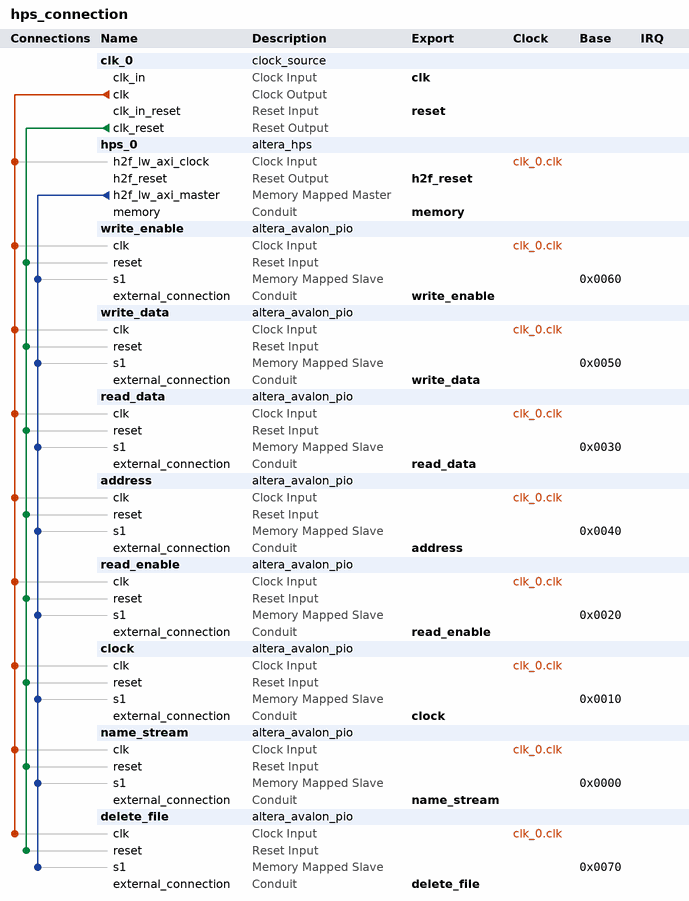
[diagram p0: system contents]
# Platform Designer (Qsys) system hps_connection, Cyclone V 5CSEMA5F31C6
# Parameters at their usual value, and those the tool derives, are not listed.
package require -exact qsys 23.1
create_system hps_connection
set_project_property DEVICE_FAMILY {Cyclone V}
set_project_property DEVICE 5CSEMA5F31C6

add_instance clk_0 clock_source 23.1
set_instance_parameter_value clk_0 clockFrequency 50000000

add_instance hps_0 altera_hps 23.1
set_instance_parameter_value hps_0 EMAC1_Mode N/A
set_instance_parameter_value hps_0 EMAC1_PinMuxing Unused
set_instance_parameter_value hps_0 F2SCLK_COLDRST_Enable false
set_instance_parameter_value hps_0 F2SCLK_DBGRST_Enable false
set_instance_parameter_value hps_0 F2SCLK_WARMRST_Enable false
set_instance_parameter_value hps_0 F2SINTERRUPT_Enable false
set_instance_parameter_value hps_0 F2S_Width 0
set_instance_parameter_value hps_0 FPGA_PERIPHERAL_OUTPUT_CLOCK_FREQ_EMAC0_GTX_CLK 125
set_instance_parameter_value hps_0 FPGA_PERIPHERAL_OUTPUT_CLOCK_FREQ_EMAC0_MD_CLK 2.5
set_instance_parameter_value hps_0 FPGA_PERIPHERAL_OUTPUT_CLOCK_FREQ_EMAC1_GTX_CLK 125
set_instance_parameter_value hps_0 FPGA_PERIPHERAL_OUTPUT_CLOCK_FREQ_EMAC1_MD_CLK 2.5
set_instance_parameter_value hps_0 HPS_PROTOCOL DDR3
set_instance_parameter_value hps_0 I2C0_Mode N/A
set_instance_parameter_value hps_0 I2C0_PinMuxing Unused
set_instance_parameter_value hps_0 I2C1_Mode N/A
set_instance_parameter_value hps_0 I2C1_PinMuxing Unused
set_instance_parameter_value hps_0 LWH2F_Enable true
set_instance_parameter_value hps_0 MEM_BANKADDR_WIDTH 3
set_instance_parameter_value hps_0 MEM_CLK_FREQ 300.0
set_instance_parameter_value hps_0 MEM_CLK_FREQ_MAX 400.0
set_instance_parameter_value hps_0 MEM_COL_ADDR_WIDTH 8
set_instance_parameter_value hps_0 MEM_DQ_WIDTH 8
set_instance_parameter_value hps_0 MEM_DRV_STR RZQ/6
set_instance_parameter_value hps_0 MEM_ROW_ADDR_WIDTH 12
set_instance_parameter_value hps_0 MEM_RTT_NOM {ODT Disabled}
set_instance_parameter_value hps_0 MEM_RTT_WR {Dynamic ODT off}
set_instance_parameter_value hps_0 MEM_TCL 7
set_instance_parameter_value hps_0 MEM_TFAW_NS 37.5
set_instance_parameter_value hps_0 MEM_TINIT_US 499
set_instance_parameter_value hps_0 MEM_TMRD_CK 3
set_instance_parameter_value hps_0 MEM_TRAS_NS 40.0
set_instance_parameter_value hps_0 MEM_TRCD_NS 15.0
set_instance_parameter_value hps_0 MEM_TREFI_US 7.0
set_instance_parameter_value hps_0 MEM_TRFC_NS 75.0
set_instance_parameter_value hps_0 MEM_TRP_NS 15.0
set_instance_parameter_value hps_0 MEM_TWTR 2
set_instance_parameter_value hps_0 MEM_VENDOR JEDEC
set_instance_parameter_value hps_0 MEM_WTCL 6
set_instance_parameter_value hps_0 MPU_EVENTS_Enable true
set_instance_parameter_value hps_0 QSPI_Mode N/A
set_instance_parameter_value hps_0 QSPI_PinMuxing Unused
set_instance_parameter_value hps_0 REF_CLK_FREQ 125.0
set_instance_parameter_value hps_0 S2FCLK_USER2CLK 5
set_instance_parameter_value hps_0 S2F_Width 0
set_instance_parameter_value hps_0 SDIO_Mode N/A
set_instance_parameter_value hps_0 SDIO_PinMuxing Unused
set_instance_parameter_value hps_0 SPIM1_Mode N/A
set_instance_parameter_value hps_0 SPIM1_PinMuxing Unused
set_instance_parameter_value hps_0 STM_Enable false
set_instance_parameter_value hps_0 TIMING_BOARD_AC_SKEW 0.02
set_instance_parameter_value hps_0 TIMING_BOARD_AC_TO_CK_SKEW 0.0
set_instance_parameter_value hps_0 TIMING_BOARD_DQ_TO_DQS_SKEW 0.0
set_instance_parameter_value hps_0 TIMING_BOARD_MAX_CK_DELAY 0.6
set_instance_parameter_value hps_0 TIMING_BOARD_MAX_DQS_DELAY 0.6
set_instance_parameter_value hps_0 TIMING_BOARD_SKEW_BETWEEN_DQS 0.02
set_instance_parameter_value hps_0 TIMING_BOARD_SKEW_CKDQS_DIMM_MAX 0.01
set_instance_parameter_value hps_0 TIMING_BOARD_SKEW_CKDQS_DIMM_MIN -0.01
set_instance_parameter_value hps_0 TIMING_BOARD_SKEW_WITHIN_DQS 0.02
set_instance_parameter_value hps_0 TIMING_TDH 125
set_instance_parameter_value hps_0 TIMING_TDQSCK 400
set_instance_parameter_value hps_0 TIMING_TDQSQ 120
set_instance_parameter_value hps_0 TIMING_TDS 50
set_instance_parameter_value hps_0 TIMING_TIH 250
set_instance_parameter_value hps_0 TIMING_TIS 175
set_instance_parameter_value hps_0 TIMING_TQSH 0.38
set_instance_parameter_value hps_0 UART0_Mode N/A
set_instance_parameter_value hps_0 UART0_PinMuxing Unused
set_instance_parameter_value hps_0 USB1_Mode N/A
set_instance_parameter_value hps_0 USB1_PinMuxing Unused
set_instance_parameter_value hps_0 desired_cfg_clk_mhz 100.0
set_instance_parameter_value hps_0 desired_qspi_clk_mhz 400.0

add_instance write_enable altera_avalon_pio 23.1
set_instance_parameter_value write_enable direction Input
set_instance_parameter_value write_enable width 1

add_instance write_data altera_avalon_pio 23.1
set_instance_parameter_value write_data direction Input
set_instance_parameter_value write_data width 32

add_instance read_data altera_avalon_pio 23.1
set_instance_parameter_value read_data direction Output
set_instance_parameter_value read_data width 32

add_instance address altera_avalon_pio 23.1
set_instance_parameter_value address direction Input
set_instance_parameter_value address width 27

add_instance read_enable altera_avalon_pio 23.1
set_instance_parameter_value read_enable direction Input
set_instance_parameter_value read_enable width 1

add_instance clock altera_avalon_pio 23.1
set_instance_parameter_value clock direction Input
set_instance_parameter_value clock width 1

add_instance name_stream altera_avalon_pio 23.1
set_instance_parameter_value name_stream direction Input
set_instance_parameter_value name_stream width 32

add_instance delete_file altera_avalon_pio 23.1
set_instance_parameter_value delete_file direction Input
set_instance_parameter_value delete_file width 1

# connections
add_connection clk_0.clk address.clk clock
add_connection clk_0.clk clock.clk clock
add_connection clk_0.clk delete_file.clk clock
add_connection clk_0.clk hps_0.h2f_lw_axi_clock clock
add_connection clk_0.clk name_stream.clk clock
add_connection clk_0.clk read_data.clk clock
add_connection clk_0.clk read_enable.clk clock
add_connection clk_0.clk write_data.clk clock
add_connection clk_0.clk write_enable.clk clock
add_connection clk_0.clk_reset address.reset reset
add_connection clk_0.clk_reset clock.reset reset
add_connection clk_0.clk_reset delete_file.reset reset
add_connection clk_0.clk_reset name_stream.reset reset
add_connection clk_0.clk_reset read_data.reset reset
add_connection clk_0.clk_reset read_enable.reset reset
add_connection clk_0.clk_reset write_data.reset reset
add_connection clk_0.clk_reset write_enable.reset reset
add_connection hps_0.h2f_lw_axi_master address.s1 avalon
set_connection_parameter_value hps_0.h2f_lw_axi_master/address.s1 baseAddress 0x0040
add_connection hps_0.h2f_lw_axi_master clock.s1 avalon
set_connection_parameter_value hps_0.h2f_lw_axi_master/clock.s1 baseAddress 0x0010
add_connection hps_0.h2f_lw_axi_master delete_file.s1 avalon
set_connection_parameter_value hps_0.h2f_lw_axi_master/delete_file.s1 baseAddress 0x0070
add_connection hps_0.h2f_lw_axi_master name_stream.s1 avalon
set_connection_parameter_value hps_0.h2f_lw_axi_master/name_stream.s1 baseAddress 0x0000
add_connection hps_0.h2f_lw_axi_master read_data.s1 avalon
set_connection_parameter_value hps_0.h2f_lw_axi_master/read_data.s1 baseAddress 0x0030
add_connection hps_0.h2f_lw_axi_master read_enable.s1 avalon
set_connection_parameter_value hps_0.h2f_lw_axi_master/read_enable.s1 baseAddress 0x0020
add_connection hps_0.h2f_lw_axi_master write_data.s1 avalon
set_connection_parameter_value hps_0.h2f_lw_axi_master/write_data.s1 baseAddress 0x0050
add_connection hps_0.h2f_lw_axi_master write_enable.s1 avalon
set_connection_parameter_value hps_0.h2f_lw_axi_master/write_enable.s1 baseAddress 0x0060

# exported interfaces
add_interface address conduit end
set_interface_property address EXPORT_OF address.external_connection
add_interface clk clock sink
set_interface_property clk EXPORT_OF clk_0.clk_in
add_interface clock conduit end
set_interface_property clock EXPORT_OF clock.external_connection
add_interface delete_file conduit end
set_interface_property delete_file EXPORT_OF delete_file.external_connection
add_interface h2f_reset reset source
set_interface_property h2f_reset EXPORT_OF hps_0.h2f_reset
add_interface memory conduit end
set_interface_property memory EXPORT_OF hps_0.memory
add_interface name_stream conduit end
set_interface_property name_stream EXPORT_OF name_stream.external_connection
add_interface read_data conduit end
set_interface_property read_data EXPORT_OF read_data.external_connection
add_interface read_enable conduit end
set_interface_property read_enable EXPORT_OF read_enable.external_connection
add_interface reset reset sink
set_interface_property reset EXPORT_OF clk_0.clk_in_reset
add_interface write_data conduit end
set_interface_property write_data EXPORT_OF write_data.external_connection
add_interface write_enable conduit end
set_interface_property write_enable EXPORT_OF write_enable.external_connection

set_interconnect_requirement {$system} qsys_mm.clockCrossingAdapter HANDSHAKE
set_interconnect_requirement {$system} qsys_mm.enableEccProtection FALSE
set_interconnect_requirement {$system} qsys_mm.insertDefaultSlave FALSE
set_interconnect_requirement {$system} qsys_mm.maxAdditionalLatency 1

save_system hps_connection.qsys
